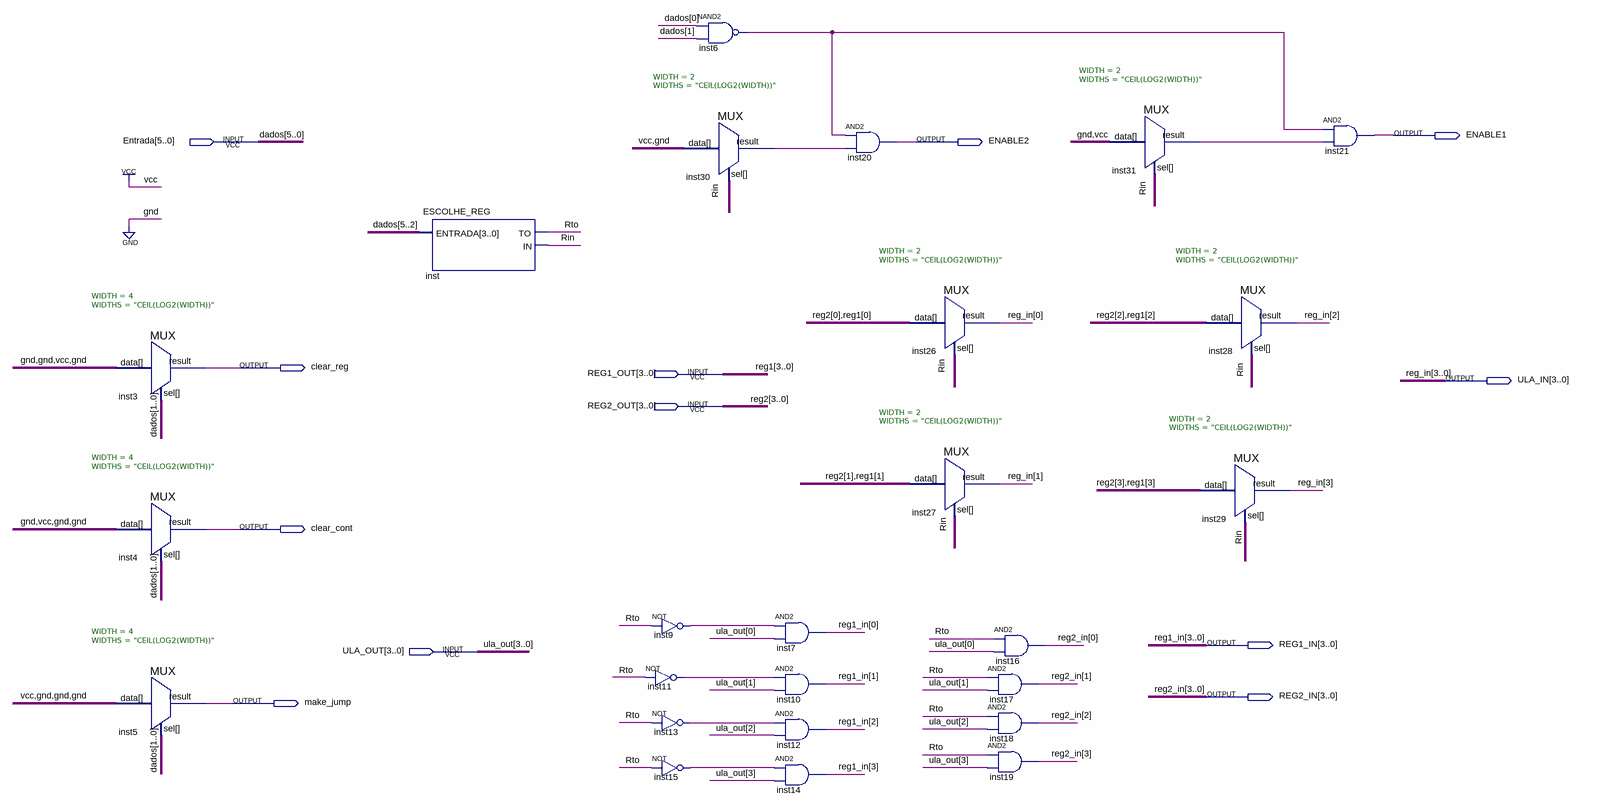
[diagram p0: schematic sheet]
// Quartus schematic uc.bdf as structural Verilog: 25 symbols, 12 pins
module uc (
  input  [5:0] Entrada,
  input  [3:0] REG1_OUT,
  input  [3:0] REG2_OUT,
  input  [3:0] ULA_OUT,
  output ENABLE1,
  output ENABLE2,
  output clear_reg,
  output [3:0] ULA_IN,
  output clear_cont,
  output [3:0] REG1_IN,
  output [3:0] REG2_IN,
  output make_jump
);

  wire inst6_out, inst9_out, inst11_out, inst13_out, inst15_out, inst30_result, inst31_result, Rin, Rto;

  MUX #(.WIDTH(4), .WIDTHS("CEIL(LOG2(WIDTH))")) inst3 (.data(4'b0010), .sel(Entrada[1:0]), .result(clear_reg));
  MUX #(.WIDTH(4), .WIDTHS("CEIL(LOG2(WIDTH))")) inst4 (.data(4'b0100), .sel(Entrada[1:0]), .result(clear_cont));
  MUX #(.WIDTH(4), .WIDTHS("CEIL(LOG2(WIDTH))")) inst5 (.data(4'b1000), .sel(Entrada[1:0]), .result(make_jump));
  ESCOLHE_REG inst (.ENTRADA(Entrada[5:2]), .TO(Rto), .IN(Rin));
  not inst9 (inst9_out, Rto);
  not inst11 (inst11_out, Rto);
  not inst13 (inst13_out, Rto);
  not inst15 (inst15_out, Rto);
  nand inst6 (inst6_out, Entrada[0], Entrada[1]);
  MUX #(.WIDTH(2), .WIDTHS("CEIL(LOG2(WIDTH))")) inst30 (.data(2'b10), .sel(Rin), .result(inst30_result));
  and inst7 (REG1_IN[0], inst9_out, ULA_OUT[0]);
  and inst10 (REG1_IN[1], inst11_out, ULA_OUT[1]);
  and inst12 (REG1_IN[2], inst13_out, ULA_OUT[2]);
  and inst14 (REG1_IN[3], inst15_out, ULA_OUT[3]);
  and inst20 (ENABLE2, inst6_out, inst30_result);
  MUX #(.WIDTH(2), .WIDTHS("CEIL(LOG2(WIDTH))")) inst26 (
    .data({REG2_OUT[0], REG1_OUT[0]}), .sel(Rin), .result(ULA_IN[0]));
  MUX #(.WIDTH(2), .WIDTHS("CEIL(LOG2(WIDTH))")) inst27 (
    .data({REG2_OUT[1], REG1_OUT[1]}), .sel(Rin), .result(ULA_IN[1]));
  and inst16 (REG2_IN[0], Rto, ULA_OUT[0]);
  and inst17 (REG2_IN[1], Rto, ULA_OUT[1]);
  and inst18 (REG2_IN[2], Rto, ULA_OUT[2]);
  and inst19 (REG2_IN[3], Rto, ULA_OUT[3]);
  MUX #(.WIDTH(2), .WIDTHS("CEIL(LOG2(WIDTH))")) inst31 (.data(2'b01), .sel(Rin), .result(inst31_result));
  MUX #(.WIDTH(2), .WIDTHS("CEIL(LOG2(WIDTH))")) inst28 (
    .data({REG2_OUT[2], REG1_OUT[2]}), .sel(Rin), .result(ULA_IN[2]));
  MUX #(.WIDTH(2), .WIDTHS("CEIL(LOG2(WIDTH))")) inst29 (
    .data({REG2_OUT[3], REG1_OUT[3]}), .sel(Rin), .result(ULA_IN[3]));
  and inst21 (ENABLE1, inst6_out, inst31_result);

  // Other names for the same wires on the sheet: dados[5:0] = Entrada; reg1[3:0] = REG1_OUT; reg2[3:0] = REG2_OUT;
  //   reg_in[3:0] = ULA_IN
endmodule
